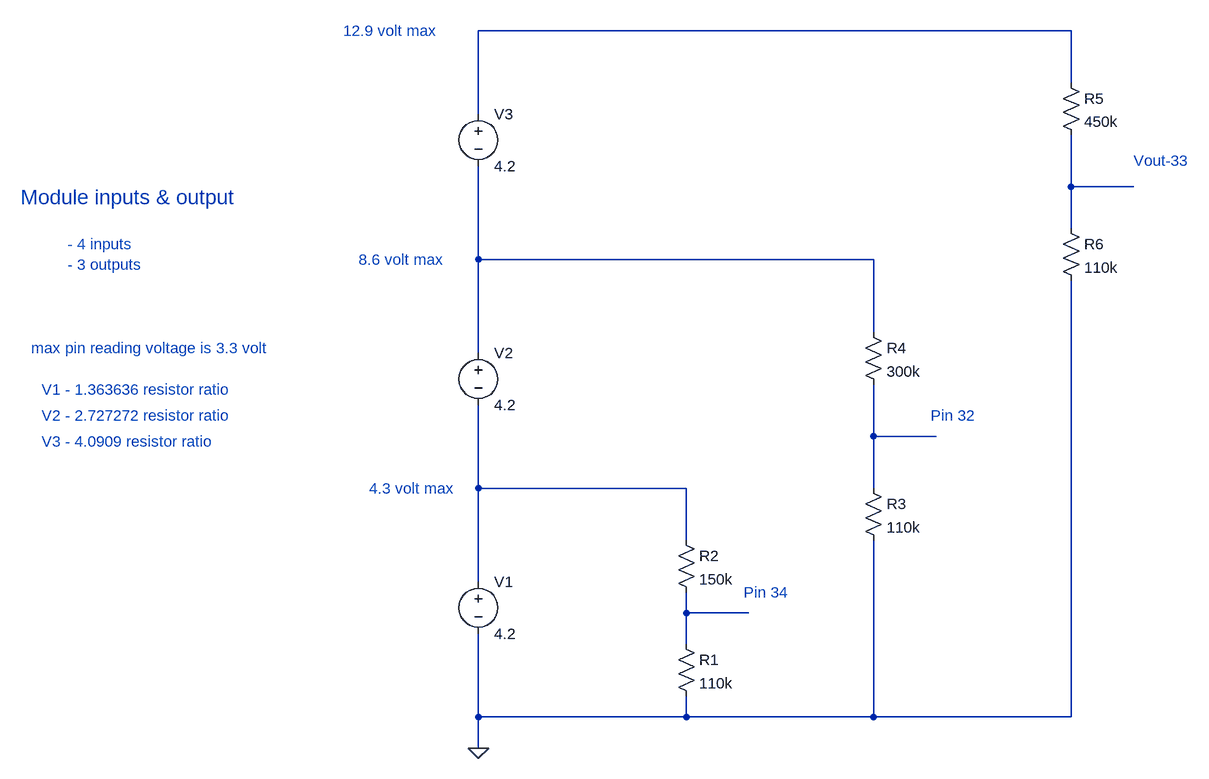
[diagram p0: schematic Voltage divider using resistors set 2.asc]
Voltage divider using resistors set 2.asc, the LTspice schematic file:
Version 4
SHEET 1 960 1060
WIRE 768 -112 -144 -112
WIRE 768 -32 768 -112
WIRE -144 16 -144 -112
WIRE 768 128 768 48
WIRE 864 128 768 128
WIRE 768 192 768 128
WIRE -144 240 -144 96
WIRE 464 240 -144 240
WIRE 464 352 464 240
WIRE -144 384 -144 240
WIRE 464 512 464 432
WIRE 560 512 464 512
WIRE -144 592 -144 464
WIRE 176 592 -144 592
WIRE 464 592 464 512
WIRE 176 672 176 592
WIRE -144 736 -144 592
WIRE 176 784 176 752
WIRE 272 784 176 784
WIRE 176 832 176 784
WIRE -144 944 -144 816
WIRE 176 944 176 912
WIRE 176 944 -144 944
WIRE 464 944 464 672
WIRE 464 944 176 944
WIRE 768 944 768 272
WIRE 768 944 464 944
WIRE -144 992 -144 944
FLAG -144 992 0
SYMBOL voltage -144 368 R0
WINDOW 123 0 0 Left 0
WINDOW 39 0 0 Left 0
SYMATTR InstName V2
SYMATTR Value 4.2
SYMBOL voltage -144 0 R0
WINDOW 123 0 0 Left 0
WINDOW 39 0 0 Left 0
SYMATTR InstName V3
SYMATTR Value 4.2
SYMBOL voltage -144 720 R0
WINDOW 123 0 0 Left 0
WINDOW 39 0 0 Left 0
SYMATTR InstName V1
SYMATTR Value 4.2
SYMBOL res 160 816 R0
SYMATTR InstName R1
SYMATTR Value 110k
SYMBOL res 160 656 R0
SYMATTR InstName R2
SYMATTR Value 150k
SYMBOL res 448 576 R0
SYMATTR InstName R3
SYMATTR Value 110k
SYMBOL res 448 336 R0
SYMATTR InstName R4
SYMATTR Value 300k
SYMBOL res 752 -48 R0
SYMATTR InstName R5
SYMATTR Value 450k
SYMBOL res 752 176 R0
SYMATTR InstName R6
SYMATTR Value 110k
TEXT 264 752 Left 2 ;Pin 34
TEXT 552 480 Left 2 ;Pin 32
TEXT 864 88 Left 2 ;Vout-33
TEXT -312 592 Left 2 ;4.3 volt max
TEXT -328 240 Left 2 ;8.6 volt max
TEXT -352 -112 Left 2 ;12.9 volt max
TEXT -848 144 Left 3 ;Module inputs & output
TEXT -776 216 Left 2 ;- 4 inputs
TEXT -776 248 Left 2 ;- 3 outputs
TEXT -832 376 Left 2 ;max pin reading voltage is 3.3 volt
TEXT -816 440 Left 2 ;V1 - 1.363636 resistor ratio
TEXT -816 480 Left 2 ;V2 - 2.727272 resistor ratio
TEXT -816 520 Left 2 ;V3 - 4.0909 resistor ratio

The netlist it stands for:
* Voltage divider using resistors set 2.asc
V2 N003 N005 4.2
V3 N001 N003 4.2
V1 N005 0 4.2
R1 N006 0 110k
R2 N005 N006 150k
R3 N004 0 110k
R4 N003 N004 300k
R5 N001 N002 450k
R6 N002 0 110k
* Pin 34
* Pin 32
* Vout-33
* 4.3 volt max
* 8.6 volt max
* 12.9 volt max
* Module inputs & output
* - 4 inputs
* - 3 outputs
* max pin reading voltage is 3.3 volt
* V1 - 1.363636 resistor ratio
* V2 - 2.727272 resistor ratio
* V3 - 4.0909 resistor ratio
.backanno
.end